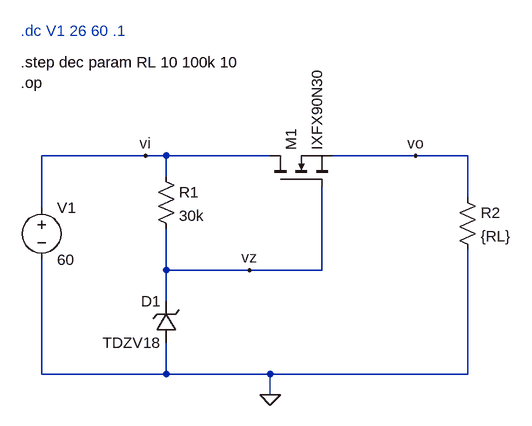
[diagram p0: schematic basic.asc]
basic.asc, the LTspice schematic file:
Version 4
SHEET 1 880 680
WIRE 96 32 -64 32
WIRE 128 32 96 32
WIRE 288 32 128 32
WIRE 512 32 384 32
WIRE 592 32 512 32
WIRE 128 64 128 32
WIRE 592 96 592 32
WIRE -64 112 -64 32
WIRE 128 208 128 144
WIRE 256 208 128 208
WIRE 368 208 368 80
WIRE 368 208 256 208
WIRE 128 256 128 208
WIRE -64 368 -64 192
WIRE 128 368 128 320
WIRE 128 368 -64 368
WIRE 288 368 128 368
WIRE 592 368 592 176
WIRE 592 368 288 368
WIRE 288 400 288 368
FLAG 288 400 0
FLAG 512 32 vo
FLAG 96 32 vi
FLAG 256 208 vz
SYMBOL voltage -64 96 R0
WINDOW 123 0 0 Left 0
WINDOW 39 0 0 Left 0
SYMATTR InstName V1
SYMATTR Value 60
SYMBOL nmos 288 80 R270
SYMATTR InstName M1
SYMATTR Value IXFX90N30
SYMBOL res 576 80 R0
SYMATTR InstName R2
SYMATTR Value {RL}
SYMBOL res 112 48 R0
SYMATTR InstName R1
SYMATTR Value 30k
SYMBOL zener 144 320 R180
WINDOW 0 24 64 Left 2
WINDOW 3 24 0 Left 2
SYMATTR InstName D1
SYMATTR Value TDZV18
TEXT -96 -160 Left 2 ;.dc V1 26 60 .1
TEXT -96 -112 Left 2 !.step dec param RL 10 100k 10
TEXT -96 -80 Left 2 !.op

The netlist it stands for:
* basic.asc
V1 vi 0 60
M1 vi vz vo vo IXFX90N30
R2 vo 0 {RL}
R1 vi vz 30k
D1 0 vz TDZV18
.model D D
.lib standard.dio
.model NMOS NMOS
.model PMOS PMOS
.lib standard.mos
* .dc V1 26 60 .1
.step dec param RL 10 100k 10
.op
.backanno
.end